# EAGLE design XYZ Magnitometer (EAGLE 6.2)
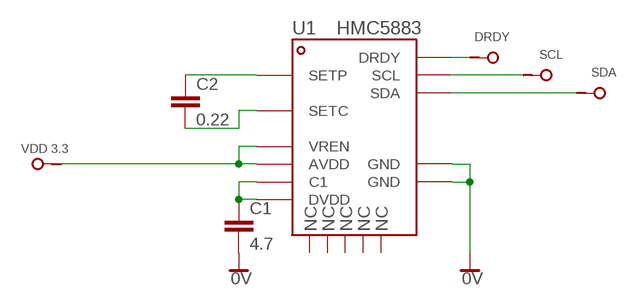
[diagram p0: schematic, sheet 1]

## Parts
C1  4.7  SMD_CAPC1206K  [C1206K]
C2  0.22  SMD_CAPC0805K  [C0805K]
P1  SDA  1_PIN_CONPLANAR  [1_PIN_PLANAR]
P2  VDD 3.3  1_PIN_CONPLANAR  [1_PIN_PLANAR]
P3  SCL  1_PIN_CONPLANAR  [1_PIN_PLANAR]
P5  DRDY  1_PIN_CONPLANAR  [1_PIN_PLANAR]
U1  HMC5883  [QFN16-4X4]

## Nets
0V: C1.2 U1.P$9(GND) U1.P$11(GND)
N$2: C1.1 U1.P$10(C1) U1.P$13(DVDD)
N$3: C2.1 U1.P$8(SETP)
N$4: C2.2 U1.P$12(SETC)
N$5: P2.P$1 U1.P$2(AVDD) U1.P$14(VREN)
N$6: P3.P$1 U1.P$1(SCL)
N$7: P1.P$1 U1.P$16(SDA)
N$8: P5.P$1 U1.P$15(DRDY)

## Power pins joined to a net without a drawn wire
1: U1.P$3
2: U1.P$4
3: U1.P$5
4: U1.P$6
5: U1.P$7

## Library data of the parts
C1 C2 = Dmitry:SMD_CAP: CAPACITOR, European symbol
P1-P3 P5 = Dmitry:1_PIN_CON
U1 = Dmitry:HMC5883

## Board
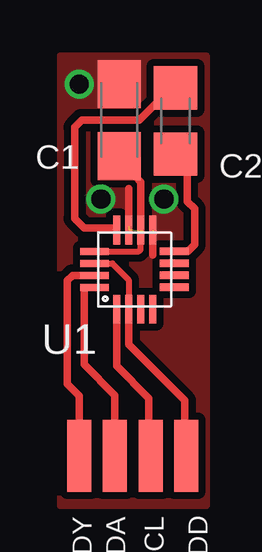
[diagram p1: board, top side]
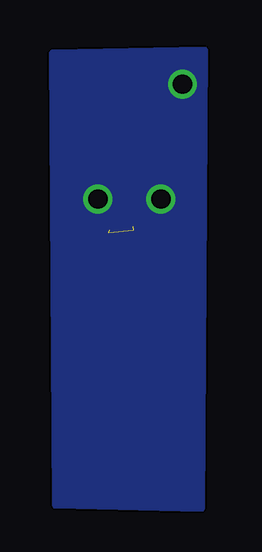
[diagram p2: board, bottom side, seen from below]

No outline drawn. Coordinates in mm, seen from the top.
Copper layers (1*16): Top 0.035mm / dielectric 1.5mm / Bottom 0.035mm
Design rules: minimum track width 10mil, minimum drill 24mil, track to track 8mil, track to pad 8mil, pad to pad 8mil, via to via 8mil, smd to smd 8mil, copper to edge 40mil, drill to drill 8mil, minimum pad ring 10mil, minimum via ring 8mil, stop-mask expansion 4mil, vias tented up to drill 0mil, thermal gap 10mil

### Footprints (pad centres in the part's own frame; a part is rotated, then mirrored left to right if it is on the bottom)
C1206K = smd 2 x 1.8: 1 -1.5,0; 2 1.5,0
C0805K = smd 1.8 x 1.8: 1 -1.381,0; 2 1.381,0
1_PIN_PLANAR = smd 3 x 1: P$1 0,0
QFN16-4X4 = smd 0.3 x 1.2: P$1 0.721,1.745; P$2 0.221,1.745; P$3 -0.279,1.745; P$4 -0.779,1.745; P$9 -0.782,-1.563; P$10 -0.282,-1.563; P$11 0.218,-1.563; P$12 0.718,-1.563 | smd 1.2 x 0.3: P$5 -1.671,0.828; P$6 -1.671,0.328; P$7 -1.671,-0.172; P$8 -1.671,-0.672; P$13 1.647,-0.668; P$14 1.647,-0.168; P$15 1.647,0.332; P$16 1.647,0.832

### Placement (x,y rotation side)
C1  17.83,18.14 90 top
C2  20.17,18.09 90 top
P1  17.65,4.13 270 top
P2  20.62,4.12 270 top
P3  19.14,4.12 270 top
P5  16.16,4.13 90 top
U1  18.44,11.98 180 top

### Tracks (layer width: path | path; a pad name or v marks a point on that pad's centre or on a via)
0V  (via drill 0.8)  (3 unrouted)
  Top 0.305: 19.26,13.43 19.23,13.43 19.23,12.5 | 18.23,15.26 18.23,13.7
  other vias: 19.69,14.83 17.06,14.83 16.16,19.63
  pour Top (isolate 0.305, no thermals): 21.46,2.03 15.36,2.03 15.36,20.83 21.46,20.83
  pour Bottom (isolate 0.254): 21.59,20.95 15.24,21.08 15.37,1.91 21.46,2.03
N$2
  Top 0.254: U1.P$13 18.64,12.65 18.72,12.72 U1.P$10
  Top 0.305: C1.1 17.63,16.74 18.72,15.55 U1.P$10
N$3
  Top 0.305: U1.P$8 20.69,12.65 20.96,12.93 20.96,14.43 20.66,14.73 20.66,16.73 20.64,16.71 C2.1 20.26,16.62
N$4
  Top 0.305: C2.2 19.87,19.34 18.66,18.13 16.26,18.13 15.96,17.83 15.96,14.03 16.36,13.63 17.64,13.63 U1.P$12
N$5
  Top 0.254: U1.P$14 17.54,12.15 18.22,11.47 U1.P$2
  Top 0.305: U1.P$2 18.22,8.77 20.56,6.43 20.56,4.17 P2.P$1
N$6
  Top 0.305: U1.P$1 17.72,7.87 19.06,6.53 19.06,4.2 P3.P$1
N$7
  Top 0.305: P1.P$1 17.65,6.64 16.36,7.93 16.36,11.15 U1.P$16
N$8
  Top 0.305: U1.P$15 15.88,11.65 15.66,11.43 15.66,7.13 16.16,6.63 P5.P$1

### Text on the board
tPlace: DRDY | SDA | SCL | VDD